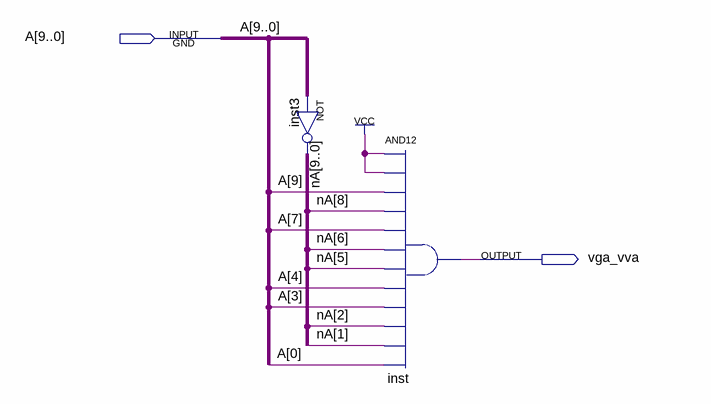
[diagram p0: schematic sheet]
// Quartus schematic vga_vva.bdf as structural Verilog: 2 symbols, 2 pins
module vga_vva (
  input  [9:0] A,
  output vga_vva
);

  wire [9:0] nA;

  assign nA = ~A;  // NOT inst3, 10 bits wide
  and inst (vga_vva, 1'b1, 1'b1, A[9], nA[8], A[7], nA[6], nA[5], A[4], A[3], nA[2], nA[1], A[0]);
endmodule
